# Altium project TMDX654GPEVM.PrjPcb (part 8 of 24)

## Sheet 22-RGMII ETHERNET PHY - MCU.SchDoc
size 513 x 386 mm
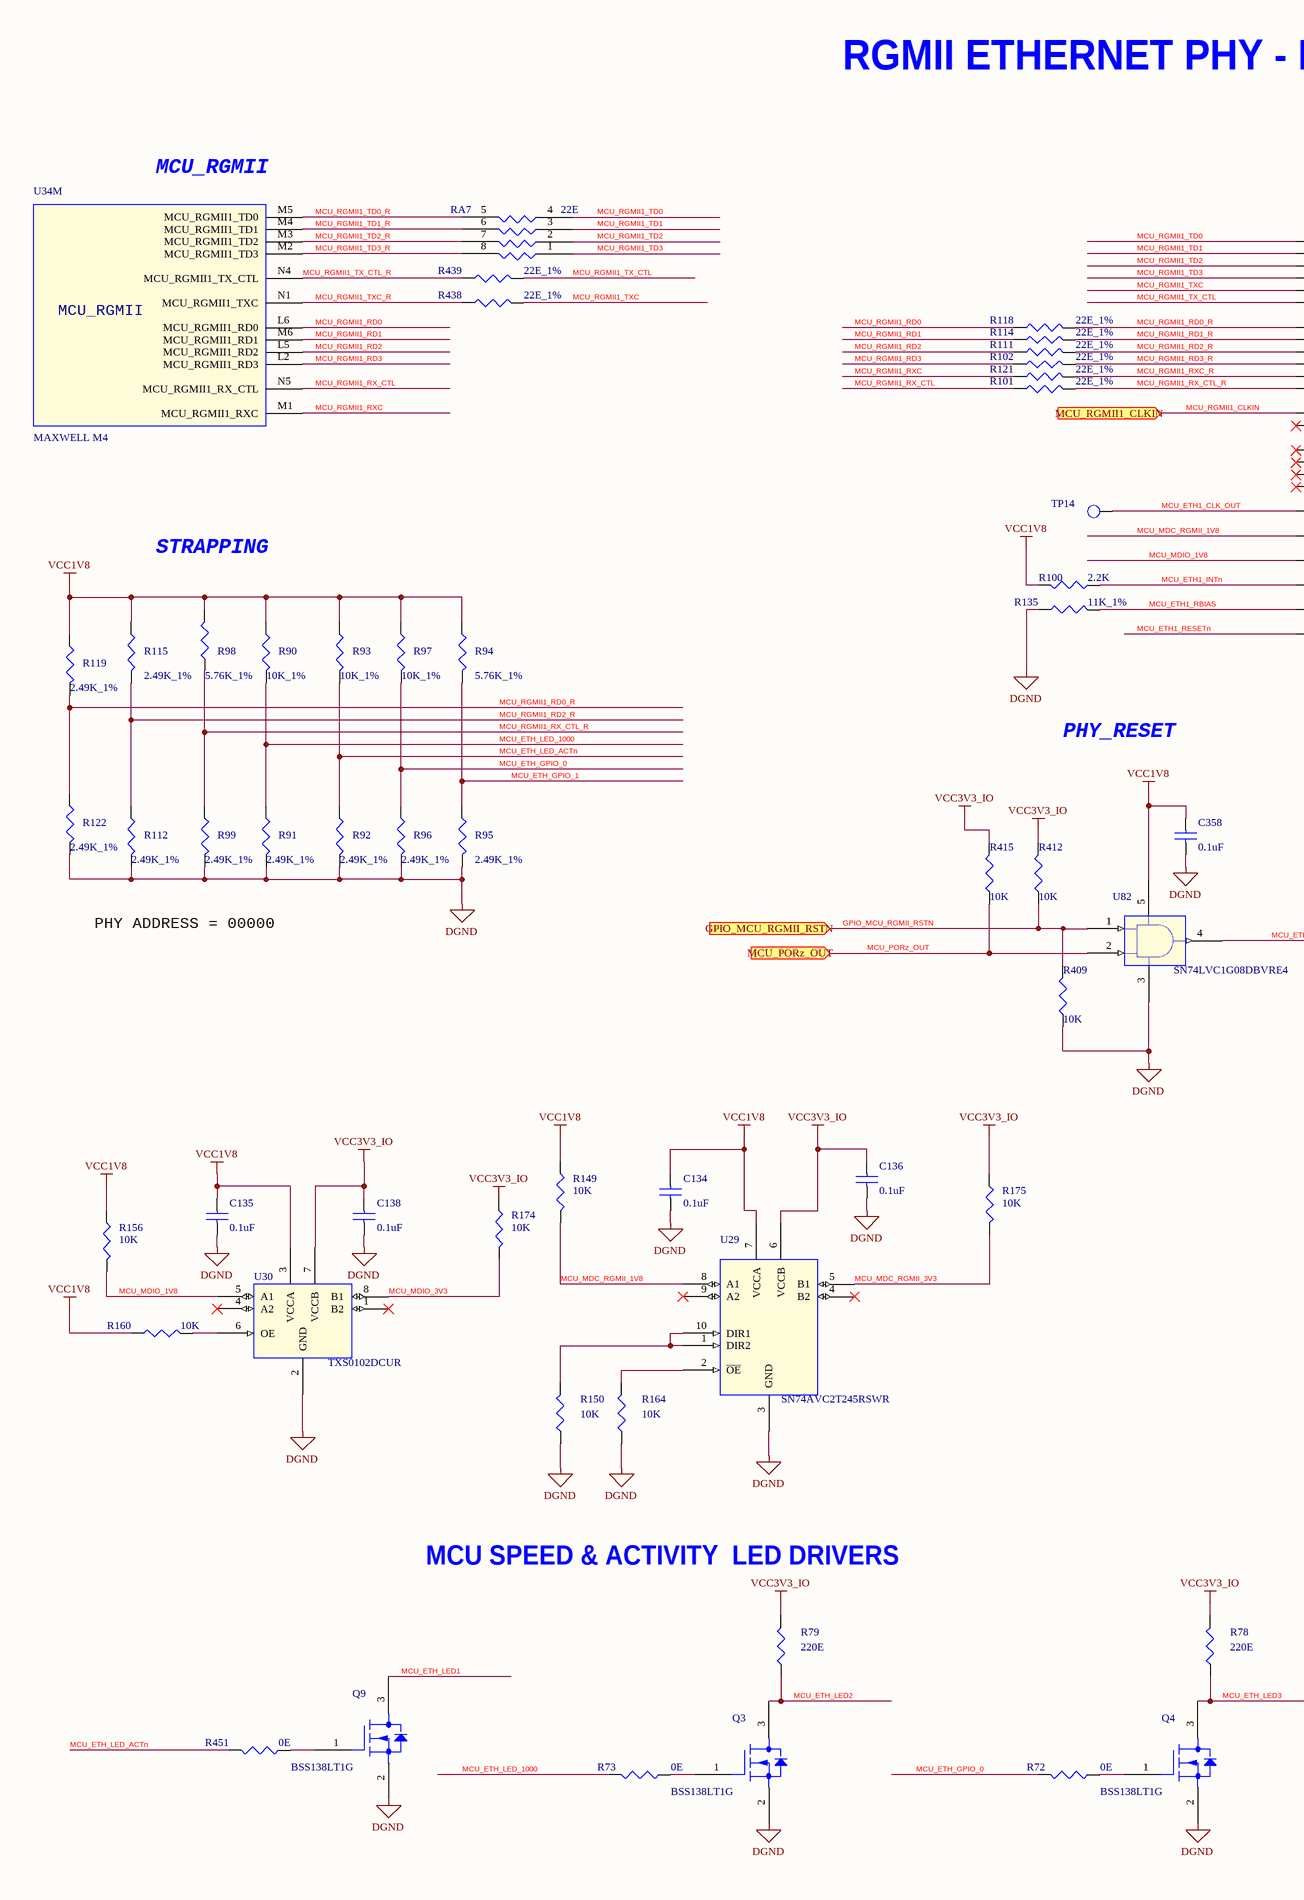
[diagram p36: 22-RGMII ETHERNET PHY - MCU.SchDoc, left]
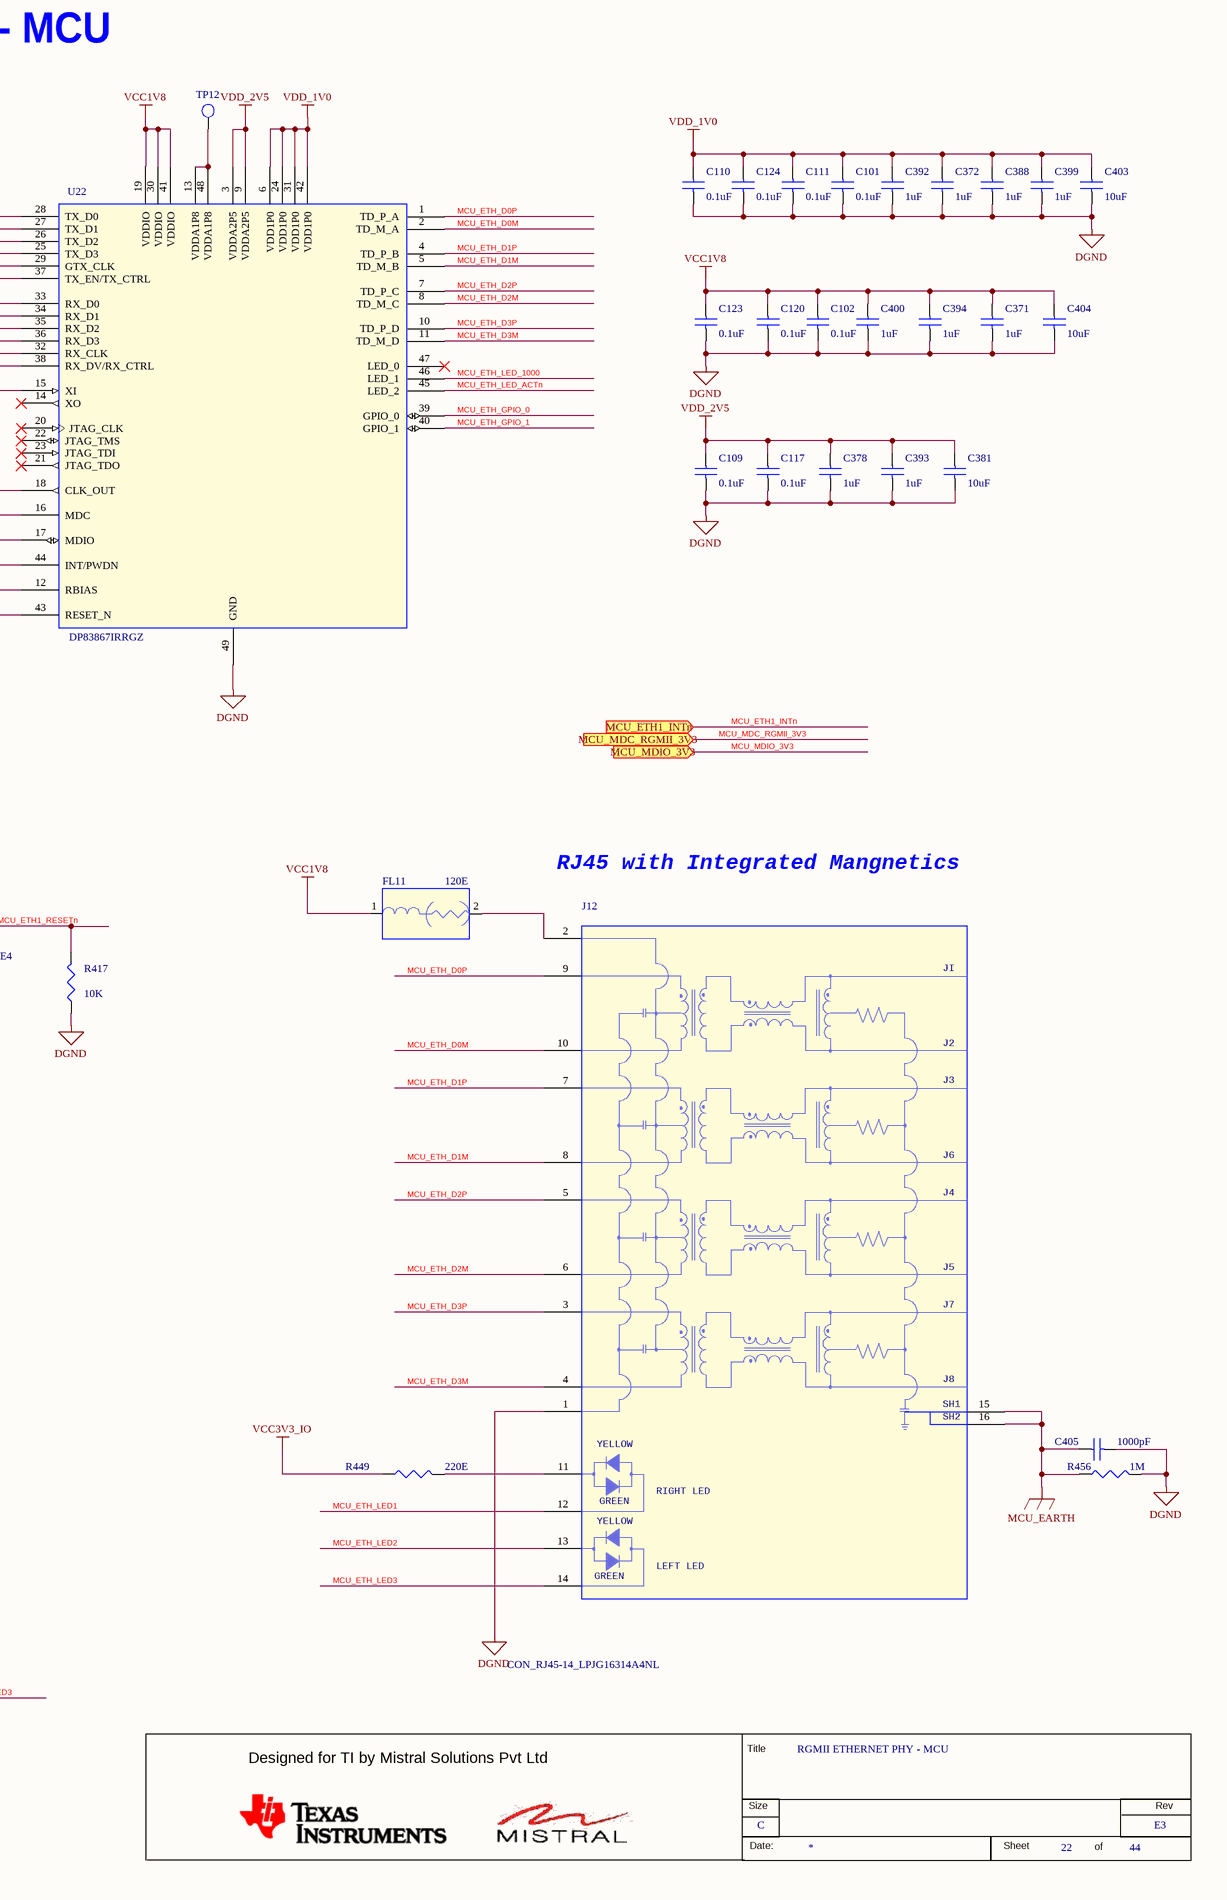
[diagram p37: 22-RGMII ETHERNET PHY - MCU.SchDoc, right]

### Parts
(Parts that share a designator on the sheet are numbered #1, #2 ... from top to bottom, then left to right.)
*#22  RevCode: E3  Title: RGMII ETHERNET PHY - MCU  Page Size: C  Page Number: 22  Page Count: 44  (hidden comment: MISTRAL_TITLEBLK_CSIZE)  (graphical)
C101  0.1uF  [CAP0201_0-5]
C102  0.1uF  [CAP0201_0-5]
C109  0.1uF  [CAP0201_0-5]
C110  0.1uF  [CAP0201_0-5]
C111  0.1uF  [CAP0201_0-5]
C117  0.1uF  [CAP0201_0-5]
C120  0.1uF  [CAP0201_0-5]
C123  0.1uF  [CAP0201_0-5]
C124  0.1uF  [CAP0201_0-5]
C134  0.1uF  [CAP0201_0-5]
C135  0.1uF  [CAP0201_0-5]
C136  0.1uF  [CAP0201_0-5]
C138  0.1uF  [CAP0201_0-5]
C358  0.1uF  [CAP0201_0-5]
C371  1uF  [CAP0402_0-75]
C372  1uF  [CAP0402_0-75]
C378  1uF  [CAP0402_0-75]
C381  10uF  [CAP0603_1]
C388  1uF  [CAP0402_0-75]
C392  1uF  [CAP0402_0-75]
C393  1uF  [CAP0402_0-75]
C394  1uF  [CAP0402_0-75]
C399  1uF  [CAP0402_0-75]
C400  1uF  [CAP0402_0-75]
C403  10uF  [CAP0603_1]
C404  10uF  [CAP0603_1]
C405  1000pF  [CAP1206]
FL11  120E  [EMIFIL_BLM15A_0402_0-6]
J12  CON_RJ45-14_LPJG16314A4NL  [CON_RJ45-14_LPJG16314A4NL_S_R_T_13-6]
Q3  BSS138LT1G  [SOT23-123]
Q4  BSS138LT1G  [SOT23-123]
Q9  BSS138LT1G  [SOT23-123]
R72  0E  [RES0402_0-5]
R73  0E  [RES0402_0-5]
R78  220E  [RES0402_0-5]
R79  220E  [RES0402_0-5]
R90  10K_1%  [RES0402_0-5]
R91  2.49K_1%  [RES0402]
R92  2.49K_1%  [RES0402]
R93  10K_1%  [RES0402_0-5]
R94  5.76K_1%  [RES0402]
R95  2.49K_1%  [RES0402]
R96  2.49K_1%  [RES0402]
R97  10K_1%  [RES0402_0-5]
R98  5.76K_1%  [RES0402]
R99  2.49K_1%  [RES0402]
R100  2.2K  [RES0402_0-5]
R101  22E_1%  [RES0402]
R102  22E_1%  [RES0402]
R111  22E_1%  [RES0402]
R112  2.49K_1%  [RES0402]
R114  22E_1%  [RES0402]
R115  2.49K_1%  [RES0402]
R118  22E_1%  [RES0402]
R119  2.49K_1%  [RES0402]
R121  22E_1%  [RES0402]
R122  2.49K_1%  [RES0402]
R135  11K_1%  [RES0402_0-5]
R149  10K  [RES0201]
R150  10K  [RES0402_0-5]
R156  10K  [RES0201]
R160  10K  [RES0402_0-5]
R164  10K  [RES0402_0-5]
R174  10K  [RES0201]
R175  10K  [RES0201]
R409  10K  [RES0402_0-5]
R412  10K  [RES0402_0-5]
R415  10K  [RES0402_0-5]
R417  10K  [RES0402_0-5]
R438  22E_1%  [RES0402]
R439  22E_1%  [RES0402]
R449  220E  [RES0402_0-5]
R451  0E  [RES0402_0-5]
R456  1M  [RES0603_0-75]
RA7  22E  [RESA_EXB28V_0402-4_0-5]
TP12  TP40_SMD  [TP40_SMD]  (value not drawn)
TP14  TP40_SMD  [TP40_SMD]  (value not drawn)
U22  DP83867IRRGZ  [QFN48_19-68_280X280_1]
U29  SN74AVC2T245RSWR  [QFN10_15-74_75X60]
U30  TXS0102DCUR  [VSSOP8_19-68_85X95_0-9]
U34  MAXWELL M4  [BGA784_31-49_910X910_1-7]  (part M of 19)
U82  SN74LVC1G08DBVRE4  [SOT23-5]

### Ports
GPIO_MCU_RGMII_RSTN (in), MCU_ETH1_INTn (in), MCU_MDC_RGMII_3V3 (in), MCU_MDIO_3V3 (in), MCU_PORz_OUT (in), MCU_RGMII1_CLKIN (in)

### Nets
DGND: C101.2 C102.2 C109.2 C110.2 C111.2 C117.2 C120.2 C123.2 C124.2 C134.2 C135.2 C136.2 C138.2 C358.2 C371.2 C372.2 C378.2 C381.2 C388.2 C392.2 C393.2 C394.2 C399.2 C400.2 C403.2 C404.2 C405.2 J12.1(CH-GND) Q3.2(S) Q4.2(S) Q9.2(S) R91.2 R92.2 R95.2 R96.2 R99.2 R112.2 R122.2 R135.2 R150.1 R164.1 R409.1 R417.2 R456.2 U22.49(GND) U29.3(GND) U30.2(GND) U82.3(GND)
MCU_EARTH: C405.1 J12.15(SH1) J12.16(SH2) R456.1
VCC1V8: C102.1 C120.1 C123.1 C134.1 C135.1 C358.1 C371.1 C394.1 C400.1 C404.1 FL11.1 R90.1 R93.1 R94.1 R97.1 R98.2 R100.2 R115.1 R119.1 R149.1 R156.1 R160.1 U22.19(VDDIO) U22.30(VDDIO) U22.41(VDDIO) U29.7(VCCA) U30.3(VCCA) U82.5(VCC)
VCC3V3_IO: C136.1 C138.1 R78.2 R79.2 R174.1 R175.1 R412.2 R415.2 R449.1 U29.6(VCCB) U30.7(VCCB)
VDD_1V0: C101.1 C110.1 C111.1 C124.1 C372.1 C388.1 C392.1 C399.1 C403.1 U22.6(VDD1P0) U22.24(VDD1P0) U22.31(VDD1P0) U22.42(VDD1P0)
VDD_2V5: C109.1 C117.1 C378.1 C381.1 C393.1 U22.3(VDDA2P5) U22.9(VDDA2P5)
GPIO_MCU_RGMII_RSTN: R409.2 R412.1 U82.1(A) ; port GPIO_MCU_RGMII_RSTN
MCU_ETH1_CLK_OUT: TP14.1(TP) U22.18(CLK_OUT)
MCU_ETH1_INTn: R100.1 U22.44(INT/PWDN) ; port MCU_ETH1_INTn
MCU_ETH1_RBIAS: R135.1 U22.12(RBIAS)
MCU_ETH1_RESETn: R417.1 U22.43(RESET_N) U82.4(Y)
MCU_ETH_D0M: J12.10(MX0-) U22.2(TD_M_A)
MCU_ETH_D0P: J12.9(MX0+) U22.1(TD_P_A)
MCU_ETH_D1M: J12.8(MX1-) U22.5(TD_M_B)
MCU_ETH_D1P: J12.7(MX1+) U22.4(TD_P_B)
MCU_ETH_D2M: J12.6(MX2-) U22.8(TD_M_C)
MCU_ETH_D2P: J12.5(MX2+) U22.7(TD_P_C)
MCU_ETH_D3M: J12.4(MX3-) U22.11(TD_M_D)
MCU_ETH_D3P: J12.3(MX3+) U22.10(TD_P_D)
MCU_ETH_GPIO_0: R72.2 R96.1 R97.2 U22.39(GPIO_0)
MCU_ETH_GPIO_1: R94.2 R95.1 U22.40(GPIO_1)
MCU_ETH_LED1: J12.12 Q9.3(D)
MCU_ETH_LED2: J12.13 Q3.3(D) R79.1
MCU_ETH_LED3: J12.14 Q4.3(D) R78.1
MCU_ETH_LED_1000: R73.2 R90.2 R91.1 U22.46(LED_1)
MCU_ETH_LED_ACTn: R92.1 R93.2 R451.2 U22.45(LED_2)
MCU_MDC_RGMII_1V8: R149.2 U22.16(MDC) U29.8(A1)
MCU_MDC_RGMII_3V3: R175.2 U29.5(B1) ; port MCU_MDC_RGMII_3V3
MCU_MDIO_1V8: R156.2 U22.17(MDIO) U30.5(A1)
MCU_MDIO_3V3: R174.2 U30.8(B1) ; port MCU_MDIO_3V3
MCU_PORz_OUT: R415.1 U82.2(B) ; port MCU_PORz_OUT
MCU_RGMII1_CLKIN: U22.15(XI) ; port MCU_RGMII1_CLKIN
MCU_RGMII1_RD0: R118.1 U34.L6(MCU_RGMII1_RD0)
MCU_RGMII1_RD0_R: R118.2 R119.2 R122.1 U22.33(RX_D0)
MCU_RGMII1_RD1: R114.1 U34.M6(MCU_RGMII1_RD1)
MCU_RGMII1_RD1_R: R114.2 U22.34(RX_D1)
MCU_RGMII1_RD2: R111.1 U34.L5(MCU_RGMII1_RD2)
MCU_RGMII1_RD2_R: R111.2 R112.1 R115.2 U22.35(RX_D2)
MCU_RGMII1_RD3: R102.1 U34.L2(MCU_RGMII1_RD3)
MCU_RGMII1_RD3_R: R102.2 U22.36(RX_D3)
MCU_RGMII1_RX_CTL: R101.1 U34.N5(MCU_RGMII1_RX_CTL)
MCU_RGMII1_RX_CTL_R: R98.1 R99.1 R101.2 U22.38(RX_DV/RX_CTRL)
MCU_RGMII1_RXC: R121.1 U34.M1(MCU_RGMII1_RXC)
MCU_RGMII1_RXC_R: R121.2 U22.32(RX_CLK)
MCU_RGMII1_TD0: RA7.4 U22.28(TX_D0)
MCU_RGMII1_TD0_R: RA7.5 U34.M5(MCU_RGMII1_TD0)
MCU_RGMII1_TD1: RA7.3 U22.27(TX_D1)
MCU_RGMII1_TD1_R: RA7.6 U34.M4(MCU_RGMII1_TD1)
MCU_RGMII1_TD2: RA7.2 U22.26(TX_D2)
MCU_RGMII1_TD2_R: RA7.7 U34.M3(MCU_RGMII1_TD2)
MCU_RGMII1_TD3: RA7.1 U22.25(TX_D3)
MCU_RGMII1_TD3_R: RA7.8 U34.M2(MCU_RGMII1_TD3)
MCU_RGMII1_TX_CTL: R439.2 U22.37(TX_EN/TX_CTRL)
MCU_RGMII1_TX_CTL_R: R439.1 U34.N4(MCU_RGMII1_TX_CTL)
MCU_RGMII1_TXC: R438.2 U22.29(GTX_CLK)
MCU_RGMII1_TXC_R: R438.1 U34.N1(MCU_RGMII1_TXC)
NetFL11_2: FL11.2 J12.2(VCC)
NetJ12_11: J12.11 R449.2
NetQ3_1: Q3.1(G) R73.1
NetQ4_1: Q4.1(G) R72.1
NetQ9_1: Q9.1(G) R451.1
NetR150_2: R150.2 U29.1(DIR2) U29.10(DIR1)
NetR160_2: R160.2 U30.6(OE)
NetR164_2: R164.2 U29.2(~{OE})
NetTP12_1: TP12.1(TP) U22.13(VDDA1P8) U22.48(VDDA1P8)

Not connected (* = marked no-connect by the designer): U22 14(XO)* 20(JTAG_CLK)* 21(JTAG_TDO)* 22(JTAG_TMS)* 23(JTAG_TDI)* 47(LED_0)*; U29 4(B2)* 9(A2)*; U30 1(B2)* 4(A2)*

### Notes on the sheet
- RGMII ETHERNET PHY - MCU
- (near U34) MCU_RGMII
- STRAPPING
- PHY_RESET
- RJ45 with Integrated Mangnetics
- PHY ADDRESS = 00000
- MCU SPEED & ACTIVITY  LED DRIVERS
- (in symbol AM654X_BGA784, part M) MCU_RGMII
- (in symbol CON_RJ45-14_LPJG16314A4NL) JI; J2; J3; J6; J4; J5; J7; J8; YELLOW; RIGHT LED; GREEN; LEFT LED
- (in symbol MISTRAL_TITLEBLK_CSIZE) Title; Designed for TI by Mistral Solutions Pvt Ltd; Size; Rev; Date:; Sheet; of

### Library data of the parts
*#22 = MISTRAL_TITLEBLK_CSIZE: Issue: 1.0; Page Create Date: March  8, 1995; Page Modify Date: *
C101 C102 C111 C117 C120 C123 = CAP_Dup5: as C126 on sheet 20-RGMII ETHERNET PHY - ICSSG PRG2_PRU0; Tolerance: 10%; Voltage: 16V; Package: 0201; Distributor_name: DIGIKEY; Distributor_part_number: 490-16742-1-ND; Height: 0.33MM; Weight: 0.33mg; Temperature: -55°C+85°C; Datasheet: Y:\MIS_DATABASE\DATASHEETS\CAPACITORS\GRM033R61C104KE84.PDF; Crtd /date: MANIRAJA/120218; Chkd/date: MANIRAJA/120218; MECHANICAL 3D STEP FILE: CAP0201_0-5; PCB Footprint: CAP0201_0-5; Library Ref: CAP
C109 C110 C124 C134-C136 C138 C358 = CAP_Dup5: as C13 on sheet 19-EEPROM,PRESENCE DETECTION & TEMP SENSOR; MECHANICAL 3D STEP FILE: CAP0201_0-5; Chkd/date: MANIRAJA/120218; Crtd /date: MANIRAJA/120218; Datasheet: Y:\MIS_DATABASE\DATASHEETS\CAPACITORS\GRM033R61C104KE84.PDF; Temperature: -55°C+85°C; Weight: 0.33mg; Height: 0.33MM; Distributor_part_number: 490-16742-1-ND; Distributor_name: DIGIKEY; Package: 0201; Voltage: 16V; Tolerance: 10%; PCB Footprint: CAP0201_0-5; Library Ref: CAP
C371 C372 C394 C399 C400 = CAP_Dup5: as C406 on sheet 20-RGMII ETHERNET PHY - ICSSG PRG2_PRU0; Footprint Path: Y:\MIS_DATABASE\Library\ALTIUM_TOOL\PCB_FOOTPRINTS\Altium_Footprint_Lib.PcbLib; Library Path: Y:\MIS_DATABASE\Library\ALTIUM_TOOL\SCHEMATICS_PARTS\MS_DISCRETE_Library.schlib; MECHANICAL 3D STEP FILE: CAP0402_0-75; PCB Footprint: CAP0402_0-75; Tolerance: 20%; Voltage: 16V; Package: 0402; Distributor_name: DIGIKEY; Distributor_part_number: 587-5514-1-ND; Height: 0.55MM; Weight: 0.65mg; Temperature: -55°C+85°C; Datasheet: Y:\MIS_DATABASE\DATASHEETS\CAPACITORS\EMK105BJ105MV-F.PDF; Crtd /date: ALVY/150218; Chkd/date: MANIRAJA/150218; Library Ref: CAP; Footprint Ref: CAP0402_0-75
C378 C388 C392 C393 = CAP_Dup5: as C424 on sheet 20-RGMII ETHERNET PHY - ICSSG PRG2_PRU0; Footprint Path: Y:\MIS_DATABASE\Library\ALTIUM_TOOL\PCB_FOOTPRINTS\Altium_Footprint_Lib.PcbLib; Library Path: Y:\MIS_DATABASE\Library\ALTIUM_TOOL\SCHEMATICS_PARTS\MS_DISCRETE_Library.schlib; MECHANICAL 3D STEP FILE: CAP0402_0-75; PCB Footprint: CAP0402_0-75; Chkd/date: MANIRAJA/150218; Crtd /date: ALVY/150218; Datasheet: Y:\MIS_DATABASE\DATASHEETS\CAPACITORS\EMK105BJ105MV-F.PDF; Temperature: -55°C+85°C; Weight: 0.65mg; Height: 0.55MM; Distributor_part_number: 587-5514-1-ND; Distributor_name: DIGIKEY; Package: 0402; Voltage: 16V; Tolerance: 20%; Library Ref: CAP; Footprint Ref: CAP0402_0-75
C381 C403 = CAP_Dup5: CAP CERAMIC 10uF 10V 10% X5R 0603; Part_type: CAPACITORS\CERAMIC; Mfr_part_number: 0603ZD106KAT2A; Mfr_name: AVX CORPORATION; Mistral Part No: 120010080001-R; Custom_Duty: 15%; Customs_HS_Code: 85322990; Project: TI_MAXIE_CPB; Wattage: NA; Chkd/date: MANIRAJA/230118; Crtd /date: MANIRAJA/230118; Datasheet: Y:\MIS_DATABASE\DATASHEETS\CAPACITORS\AVX_MLC.PDF; Height: 0.94MM; Distributor_part_number: 478-10766-1-ND; Distributor_name: DIGIKEY; Package: 0603; Voltage: 10V; Tolerance: 10%; PCB Footprint: CAP0603_1; Weight: 2mg; Temperature: -55°C+85°C; MECHANICAL 3D STEP FILE: CAP0603_1; Library Ref: CAP
C404 = CAP_Dup5: as C471 on sheet 20-RGMII ETHERNET PHY - ICSSG PRG2_PRU0; Tolerance: 10%; Voltage: 10V; Package: 0603; Distributor_name: DIGIKEY; Distributor_part_number: 478-10766-1-ND; Height: 0.94MM; Datasheet: Y:\MIS_DATABASE\DATASHEETS\CAPACITORS\AVX_MLC.PDF; Crtd /date: MANIRAJA/230118; Chkd/date: MANIRAJA/230118; PCB Footprint: CAP0603_1; Weight: 2mg; Temperature: -55°C+85°C; MECHANICAL 3D STEP FILE: CAP0603_1; Library Ref: CAP
C405 = CAP_Dup5: as C489 on sheet 20-RGMII ETHERNET PHY - ICSSG PRG2_PRU0; Tolerance: 10%; Voltage: 2KV; Package: 1206; Distributor_name: DIGIKEY; Distributor_part_number: 478-2956-1-ND; Height: 1.50MM; Weight: NA; Temperature: -55°C+125°C; Datasheet: Y:\MIS_DATABASE\DATASHEETS\CAPACITORS\AVX_MLC.PDF; Crtd /date: MAZHAR/281106; Chkd/date: SHREESHAIL/291106; PCB Footprint: CAP1206; Library Ref: CAP; Footprint Ref: CAP1206; Library Path: Y:\MIS_DATABASE\Library\ALTIUM_TOOL\SCHEMATICS_PARTS\MS_DISCRETE_Library.schlib; Footprint Path: Y:\MIS_DATABASE\Library\ALTIUM_TOOL\PCB_FOOTPRINTS\Altium_Footprint_Lib.PcbLib
FL11 = EMIFILTER_IND: FERRITE CHIP 120E 1.3A 0402; Mistral Part No: 130012030043-R; Mfr_name: MURATA; Mfr_part_number: BLM15PD121SN1; Part_type: MISC\FILTER; Project: GEN_3-8; Tolerance: 25%; Voltage: NA; Customs_HS_Code: 85437099; Custom_Duty: 24%; Wattage: NA; Package: 0402; Distributor_name: DIGIKEY; Distributor_part_number: 490-5203-1-ND; Height: 0.55MM; Weight: 0.65mg; Temperature: -55°C+125°C; Datasheet: Y:\MIS_DATABASE\DATASHEETS\DISCRETES\INDUCTORS\BLM18K-SERIES.PDF; Crtd /date: CHAITHANYA/150312; Chkd/date: VASANTHA/010117; MECHANICAL 3D STEP FILE: EMIFIL_BLM15A_0402_0-6; PCB Footprint: EMIFIL_BLM15A_0402_0-6; Library Ref: EMIFILTER_IND; Footprint Ref: EMIFIL_BLM15A_0402_0-6; Library Path: Y:\MIS_DATABASE\Library\ALTIUM_TOOL\SCHEMATICS_PARTS\MS_FILTER_Library.schlib; Footprint Path: Y:\MIS_DATABASE\Library\ALTIUM_TOOL\PCB_FOOTPRINTS\Altium_Footprint_Lib.PcbLib
J12 = CON_RJ45-14_LPJG16314A4NL: CON RJ-45 FEMALE 14POS RT TH; Part_type: CONNECTOR\JACK; Mfr_name: LINK-PP; Mistral Part No: 150014060029-R; Custom_Duty: 24%; Customs_HS_Code: 85369090; Wattage: NA; Project: AEGIS; MECHANICAL 3D STEP FILE: CON_RJ45-14_LPJG16314A4NL_S_R_T_13-6; Chkd/date: VASANTHA/150714; Crtd /date: BALACHANDAR/120614; Datasheet: Y:\MIS_DATABASE\DATASHEETS\CONNECTORS\LPJG16314A4NL.PDF; Temperature: -0°C+70°C; Weight: NA; Height: 13.60MM; Distributor_part_number: NA; Distributor_name: NA; Package: THRU-HOLE; Voltage: NA; Tolerance: NA; Mfr_part_number: LPJG16314A4NL; PCB Footprint: CON_RJ45-14_LPJG16314A4NL_S_R_T_13-6; Library Ref: CON_RJ45-14_LPJG16314A4NL; Footprint Ref: CON_RJ45-14_LPJG16314A4NL_S_R_T_13-6; Library Path: Y:\MIS_DATABASE\Library\ALTIUM_TOOL\SCHEMATICS_PARTS\MS_CONNECTOR_Library.schlib; Footprint Path: Y:\MIS_DATABASE\Library\ALTIUM_TOOL\PCB_FOOTPRINTS\Altium_Footprint_Lib.PcbLib
Q3 Q4 Q9 = MOSFET_BSS138LT1G: as Q13 on sheet 20-RGMII ETHERNET PHY - ICSSG PRG2_PRU0; PCB Footprint: SOT23-123; Mfr_part_number: BSS138LT1G; Voltage: 50V; Wattage: NA; Package: SOT23-3; Distributor_name: MOUSER; Distributor_part_number: 863-BSS138LT1G; Height: 1.11MM; Weight: NA; Temperature: -55°C+150°C; Datasheet: Y:\MIS_DATABASE\DATASHEETS\DISCRETES\TRANSISTORS_FETS\BSS138LT1G.PDF; Crtd /date: JEBRAN/060416; Chkd/date: VASANTHA/150416; Library Ref: MOSFET_BSS138LT1G
R72 R73 R451 = RESISTOR_Dup4: as R468 on sheet 20-RGMII ETHERNET PHY - ICSSG PRG2_PRU0; MECHANICAL 3D STEP FILE: RES0402_0-5; PCB Footprint: RES0402_0-5; Voltage: NA; Wattage: 1/16W; Package: 0402; Distributor_name: DIGIKEY; Distributor_part_number: 541-0.0JCT-ND; Height: 0.40MM; Weight: 0.65g/1000pcs; Temperature: -55°C+155°C; Datasheet: Y:\MIS_DATABASE\DATASHEETS\RESISTORS\CRCW0603.PDF; Crtd /date: MUDDU/190810; Chkd/date: VASANTHA/201216; RoHS: Pb-Free; Library Ref: RESISTOR; Footprint Ref: RES0402_0-5; Library Path: Y:\MIS_DATABASE\Library\ALTIUM_TOOL\SCHEMATICS_PARTS\MS_DISCRETE_Library.schlib; Footprint Path: Y:\MIS_DATABASE\Library\ALTIUM_TOOL\PCB_FOOTPRINTS\Altium_Footprint_Lib.PcbLib
R78 R79 = RESISTOR_Dup5: RES 220E 1/16W 5% 0402; Mistral Part No: 110009030506-R; Mfr_name: PANASONIC-ECG; Mfr_part_number: ERJ-2GEJ221X; Part_type: RESISTORS\FIXED; Project: RED EYE; Customs_HS_Code: 85332119; Custom_Duty: 15%; Voltage: NA; Tolerance: 5%; Wattage: 1/16W; Package: 0402; Distributor_name: DIGIKEY; Distributor_part_number: P220JCT-ND; Height: 0.40MM; Datasheet: Y:\MIS_DATABASE\DATASHEETS\RESISTORS\ERJ12.PDF; Crtd /date: GEETHA/260406; Chkd/date: VASANTHA/291216; Library Ref: RESISTOR; PCB Footprint: RES0402_0-5; Weight: 0.8g/1000pcs; Temperature: -55°C+155°C; MECHANICAL 3D STEP FILE: RES0402_0-5; Library Path: Y:\MIS_DATABASE\Library\ALTIUM_TOOL\SCHEMATICS_PARTS\MS_DISCRETE_Library.schlib; Footprint Path: Y:\MIS_DATABASE\Library\ALTIUM_TOOL\PCB_FOOTPRINTS\Altium_Footprint_Lib.PcbLib
R90 R93 = RESISTOR_Dup5: as R144 on sheet 20-RGMII ETHERNET PHY - ICSSG PRG2_PRU0; RoHS: Pb-Free; Chkd/date: VASANTHA/201216; Crtd /date: GEETHA/290506; Datasheet: Y:\MIS_DATABASE\DATASHEETS\RESISTORS\YAGEO-RC0402.PDF; Temperature: -55°C+155°C; Weight: 0.65mg; Height: 0.40MM; Distributor_part_number: 311-10.0KLRTR-ND; Distributor_name: DIGIKEY; Package: 0402; Wattage: 1/16W; Tolerance: 1%; MECHANICAL 3D STEP FILE: RES0402_0-5; PCB Footprint: RES0402_0-5; Library Ref: RESISTOR; Footprint Ref: RES0402_0-5; Library Path: Y:\MIS_DATABASE\Library\ALTIUM_TOOL\SCHEMATICS_PARTS\MS_DISCRETE_Library.schlib; Footprint Path: Y:\MIS_DATABASE\Library\ALTIUM_TOOL\PCB_FOOTPRINTS\Altium_Footprint_Lib.PcbLib
R91 R92 R95 R96 R99 R112 R115 R122 = RESISTOR_Dup5: as R138 on sheet 20-RGMII ETHERNET PHY - ICSSG PRG2_PRU0; Tolerance: 1%; Wattage: 1/16W; Package: 0402; Distributor_name: DIGIKEY; Distributor_part_number: 311-2.49KLRCT-ND; Height: 0.40MM; Weight: NA; Temperature: -55°C+155°C; Datasheet: Y:\MIS_DATABASE\DATASHEETS\RESISTORS\RC0402FR.PDF; Crtd /date: VASANTHA/270516; Chkd/date: VASANTHA/270516; PCB Footprint: RES0402; Library Ref: RESISTOR
R94 = RESISTOR_Dup5: as R145 on sheet 20-RGMII ETHERNET PHY - ICSSG PRG2_PRU0; Tolerance: 1%; Wattage: 1/10W; Package: 0402; Distributor_name: DIGIKEY; Distributor_part_number: P5.76KLCT-ND; Height: 0.40MM; Datasheet: Y:\MIS_DATABASE\DATASHEETS\RESISTORS\PAN-ERJSERIES.PDF; Crtd /date: USMAN/220808; Chkd/date: MAZHAR/150709; PCB Footprint: RES0402; Library Ref: RESISTOR; Library Path: Y:\MIS_DATABASE\Library\ALTIUM_TOOL\SCHEMATICS_PARTS\MS_DISCRETE_Library.schlib; Footprint Path: Y:\MIS_DATABASE\Library\ALTIUM_TOOL\PCB_FOOTPRINTS\Altium_Footprint_Lib.PcbLib
R97 = RESISTOR_Dup5: as R137 on sheet 20-RGMII ETHERNET PHY - ICSSG PRG2_PRU0; Tolerance: 1%; Wattage: 1/16W; Package: 0402; Distributor_name: DIGIKEY; Distributor_part_number: 311-10.0KLRTR-ND; Height: 0.40MM; Weight: 0.65mg; Temperature: -55°C+155°C; Datasheet: Y:\MIS_DATABASE\DATASHEETS\RESISTORS\YAGEO-RC0402.PDF; Crtd /date: GEETHA/290506; Chkd/date: VASANTHA/201216; RoHS: Pb-Free; MECHANICAL 3D STEP FILE: RES0402_0-5; PCB Footprint: RES0402_0-5; Library Ref: RESISTOR; Footprint Ref: RES0402_0-5; Library Path: Y:\MIS_DATABASE\Library\ALTIUM_TOOL\SCHEMATICS_PARTS\MS_DISCRETE_Library.schlib; Footprint Path: Y:\MIS_DATABASE\Library\ALTIUM_TOOL\PCB_FOOTPRINTS\Altium_Footprint_Lib.PcbLib
R98 = RESISTOR_Dup5: as R141 on sheet 20-RGMII ETHERNET PHY - ICSSG PRG2_PRU0; Chkd/date: MAZHAR/150709; Crtd /date: USMAN/220808; Datasheet: Y:\MIS_DATABASE\DATASHEETS\RESISTORS\PAN-ERJSERIES.PDF; Height: 0.40MM; Distributor_part_number: P5.76KLCT-ND; Distributor_name: DIGIKEY; Package: 0402; Wattage: 1/10W; Tolerance: 1%; PCB Footprint: RES0402; Library Ref: RESISTOR; Library Path: Y:\MIS_DATABASE\Library\ALTIUM_TOOL\SCHEMATICS_PARTS\MS_DISCRETE_Library.schlib; Footprint Path: Y:\MIS_DATABASE\Library\ALTIUM_TOOL\PCB_FOOTPRINTS\Altium_Footprint_Lib.PcbLib
R100 = RESISTOR_Dup5: as R198 on sheet 20-RGMII ETHERNET PHY - ICSSG PRG2_PRU0; Footprint Path: VALUE IS VAILABLE 3 TIMES; MECHANICAL 3D STEP FILE: RES0402_0-5; Chkd/date: VASANTHA/061216; Crtd /date: BAVISH/021210; Datasheet: Y:\MIS_DATABASE\DATASHEETS\RESISTORS\YAGEO.PDF; Temperature: -55°C+155°C; Weight: 0.65mg; Height: 0.40MM; Distributor_part_number: 311-2.2KJRCT-ND; Distributor_name: DIGIKEY; Package: 0402; Wattage: 1/16W; Tolerance: 5%; PCB Footprint: RES0402_0-5; Library Ref: RESISTOR
R101 R111 R118 R438 = RESISTOR_Dup5: as R154 on sheet 20-RGMII ETHERNET PHY - ICSSG PRG2_PRU0; RoHS: Pb-Free; Chkd/date: SUHAS/290910; Crtd /date: MAZHAR/090909; Datasheet: Y:\MIS_DATABASE\DATASHEETS\RESISTORS\YAGEO-RC0402.PDF; Temperature: -55°C+155°C; Weight: 0.8g/1000pcs; Height: 0.40MM; Distributor_part_number_A: 541-22.0LCT-ND; Distributor_name_A: DIGIKEY; Distributor_part_number: 311-22.0LRCT-ND; Distributor_name: DIGIKEY; Package: 0402; Wattage: 1/16W; Tolerance: 1%; PCB Footprint: RES0402; SIGNAL_MODEL: RES; Library Ref: RESISTOR
R102 R114 R121 R439 = RESISTOR_Dup5: as R152 on sheet 20-RGMII ETHERNET PHY - ICSSG PRG2_PRU0; Tolerance: 1%; Wattage: 1/16W; Package: 0402; Distributor_name: DIGIKEY; Distributor_part_number: 311-22.0LRCT-ND; Distributor_name_A: DIGIKEY; Distributor_part_number_A: 541-22.0LCT-ND; Height: 0.40MM; Weight: 0.8g/1000pcs; Temperature: -55°C+155°C; Datasheet: Y:\MIS_DATABASE\DATASHEETS\RESISTORS\YAGEO-RC0402.PDF; Crtd /date: MAZHAR/090909; Chkd/date: SUHAS/290910; RoHS: Pb-Free; PCB Footprint: RES0402; SIGNAL_MODEL: RES; Library Ref: RESISTOR
R119 = RESISTOR_Dup5: as R142 on sheet 20-RGMII ETHERNET PHY - ICSSG PRG2_PRU0; Chkd/date: VASANTHA/270516; Crtd /date: VASANTHA/270516; Datasheet: Y:\MIS_DATABASE\DATASHEETS\RESISTORS\RC0402FR.PDF; Temperature: -55°C+155°C; Weight: NA; Height: 0.40MM; Distributor_part_number: 311-2.49KLRCT-ND; Distributor_name: DIGIKEY; Package: 0402; Wattage: 1/16W; Tolerance: 1%; PCB Footprint: RES0402; Library Ref: RESISTOR
R135 = RESISTOR_Dup5: as R188 on sheet 20-RGMII ETHERNET PHY - ICSSG PRG2_PRU0; Tolerance: 1%; Wattage: 1/16W; Package: 0402; Distributor_name: DIGIKEY; Distributor_part_number: 311-11.0KLRCT-ND; Height: 0.40MM; Weight: 0.65mg; Temperature: -55°C+155°C; Datasheet: Y:\MIS_DATABASE\DATASHEETS\RESISTORS\YAGEO-RC0402.PDF; Crtd /date: VASANTHA/251115; Chkd/date: VASANTHA/251115; RoHS: Pb-Free; MECHANICAL 3D STEP FILE: RES0402_0-5; PCB Footprint: RES0402_0-5; Library Ref: RESISTOR
R149 R175 = RESISTOR_Dup5: RES 10K 1/20W 5% 0201; Mistral Part No: 110010070051-R; Mfr_name: NIC COMPONENTS; Mfr_part_number: NRC02J103TRF; Part_type: RESISTORS\FIXED; Alternate_mfr_name_A: KOA SPEER; Alternate_mfr_part_number_A: RK73B1HTTC103J; Project: PB_BUGBASE; Voltage: 50V; Customs_HS_Code: 85332119; Custom_Duty: 15%; NI_MARK: DNI; PCB Footprint: RES0201; Library Ref: RESISTOR; Tolerance: 5%; Wattage: 1/20W; Package: 0201; Distributor_name: NA; Distributor_part_number: NA; Distributor_name_A: NA; Distributor_part_number_A: NA; Height: 0.30MM; Weight: NA; Temperature: -55°C+125°C; Datasheet: Y:\MIS_DATABASE\DATASHEETS\RESISTORS\NRC SERIES.PDF; Crtd /date: MUDDU/100710; Chkd/date: SUHAS/280910
R150 R164 R415 = RESISTOR_Dup5: as R20 on sheet 19-EEPROM,PRESENCE DETECTION & TEMP SENSOR; MECHANICAL 3D STEP FILE: RES0402_0-5; RoHS: Pb-Free; Chkd/date: VASANTHA/061216; Crtd /date: MAZHAR/230805; Datasheet: Y:\MIS_DATABASE\DATASHEETS\RESISTORS\YAGEO-RC0402.PDF; Temperature: -55°C+155°C; Weight: 0.65mg; Height: 0.40MM; Distributor_part_number: 311-10KJRCT-ND; Distributor_name: DIGIKEY; Package: 0402; Wattage: 1/16W; Tolerance: 5%; PCB Footprint: RES0402_0-5; Library Ref: RESISTOR; Footprint Ref: RES0402_0-5; Library Path: Y:\MIS_DATABASE\Library\ALTIUM_TOOL\SCHEMATICS_PARTS\MS_DISCRETE_Library.schlib; Footprint Path: Y:\MIS_DATABASE\Library\ALTIUM_TOOL\PCB_FOOTPRINTS\Altium_Footprint_Lib.PcbLib
R156 R174 = RESISTOR_Dup5: RES 10K 1/20W 5% 0201; Alternate_mfr_part_number_A: RK73B1HTTC103J; Alternate_mfr_name_A: KOA SPEER; Part_type: RESISTORS\FIXED; Mfr_part_number: NRC02J103TRF; Mfr_name: NIC COMPONENTS; Mistral Part No: 110010070051-R; Custom_Duty: 15%; Customs_HS_Code: 85332119; Voltage: 50V; Project: PB_BUGBASE; NI_MARK: DNI; Chkd/date: SUHAS/280910; Crtd /date: MUDDU/100710; Datasheet: Y:\MIS_DATABASE\DATASHEETS\RESISTORS\NRC SERIES.PDF; Temperature: -55°C+125°C; Weight: NA; Height: 0.30MM; Distributor_part_number_A: NA; Distributor_name_A: NA; Distributor_part_number: NA; Distributor_name: NA; Package: 0201; Wattage: 1/20W; Tolerance: 5%; PCB Footprint: RES0201; Library Ref: RESISTOR
R160 R412 = RESISTOR_Dup5: as R22 on sheet 19-EEPROM,PRESENCE DETECTION & TEMP SENSOR; Tolerance: 5%; Wattage: 1/16W; Package: 0402; Distributor_name: DIGIKEY; Distributor_part_number: 311-10KJRCT-ND; Height: 0.40MM; Weight: 0.65mg; Temperature: -55°C+155°C; Datasheet: Y:\MIS_DATABASE\DATASHEETS\RESISTORS\YAGEO-RC0402.PDF; Crtd /date: MAZHAR/230805; Chkd/date: VASANTHA/061216; RoHS: Pb-Free; MECHANICAL 3D STEP FILE: RES0402_0-5; PCB Footprint: RES0402_0-5; Library Ref: RESISTOR; Footprint Ref: RES0402_0-5; Library Path: Y:\MIS_DATABASE\Library\ALTIUM_TOOL\SCHEMATICS_PARTS\MS_DISCRETE_Library.schlib; Footprint Path: Y:\MIS_DATABASE\Library\ALTIUM_TOOL\PCB_FOOTPRINTS\Altium_Footprint_Lib.PcbLib
R409 = RESISTOR_Dup5: as R21 on sheet 19-EEPROM,PRESENCE DETECTION & TEMP SENSOR; MECHANICAL 3D STEP FILE: RES0402_0-5; RoHS: Pb-Free; Chkd/date: VASANTHA/061216; Crtd /date: MAZHAR/230805; Datasheet: Y:\MIS_DATABASE\DATASHEETS\RESISTORS\YAGEO-RC0402.PDF; Temperature: -55°C+155°C; Weight: 0.65mg; Height: 0.40MM; Distributor_part_number: 311-10KJRCT-ND; Distributor_name: DIGIKEY; Package: 0402; Wattage: 1/16W; Tolerance: 5%; PCB Footprint: RES0402_0-5; Library Ref: RESISTOR; Footprint Ref: RES0402_0-5; Library Path: Y:\MIS_DATABASE\Library\ALTIUM_TOOL\SCHEMATICS_PARTS\MS_DISCRETE_Library.schlib; Footprint Path: Y:\MIS_DATABASE\Library\ALTIUM_TOOL\PCB_FOOTPRINTS\Altium_Footprint_Lib.PcbLib
R417 = RESISTOR_Dup5: as R19 on sheet 19-EEPROM,PRESENCE DETECTION & TEMP SENSOR; Tolerance: 5%; Wattage: 1/16W; Package: 0402; Distributor_name: DIGIKEY; Distributor_part_number: 311-10KJRCT-ND; Height: 0.40MM; Weight: 0.65mg; Temperature: -55°C+155°C; Datasheet: Y:\MIS_DATABASE\DATASHEETS\RESISTORS\YAGEO-RC0402.PDF; Crtd /date: MAZHAR/230805; Chkd/date: VASANTHA/061216; RoHS: Pb-Free; MECHANICAL 3D STEP FILE: RES0402_0-5; PCB Footprint: RES0402_0-5; Library Ref: RESISTOR; Footprint Ref: RES0402_0-5; Library Path: Y:\MIS_DATABASE\Library\ALTIUM_TOOL\SCHEMATICS_PARTS\MS_DISCRETE_Library.schlib; Footprint Path: Y:\MIS_DATABASE\Library\ALTIUM_TOOL\PCB_FOOTPRINTS\Altium_Footprint_Lib.PcbLib
R449 = RESISTOR_Dup5: RES 220E 1/16W 5% 0402; Part_type: RESISTORS\FIXED; Mfr_part_number: ERJ-2GEJ221X; Mfr_name: PANASONIC-ECG; Mistral Part No: 110009030506-R; Custom_Duty: 15%; Customs_HS_Code: 85332119; Project: RED EYE; Voltage: NA; Chkd/date: VASANTHA/291216; Crtd /date: GEETHA/260406; Datasheet: Y:\MIS_DATABASE\DATASHEETS\RESISTORS\ERJ12.PDF; Height: 0.40MM; Distributor_part_number: P220JCT-ND; Distributor_name: DIGIKEY; Package: 0402; Wattage: 1/16W; Tolerance: 5%; Library Ref: RESISTOR; PCB Footprint: RES0402_0-5; Weight: 0.8g/1000pcs; Temperature: -55°C+155°C; MECHANICAL 3D STEP FILE: RES0402_0-5; Library Path: Y:\MIS_DATABASE\Library\ALTIUM_TOOL\SCHEMATICS_PARTS\MS_DISCRETE_Library.schlib; Footprint Path: Y:\MIS_DATABASE\Library\ALTIUM_TOOL\PCB_FOOTPRINTS\Altium_Footprint_Lib.PcbLib
R456 = RESISTOR_Dup5: as R473 on sheet 20-RGMII ETHERNET PHY - ICSSG PRG2_PRU0; MECHANICAL 3D STEP FILE: RES0603_0-75; Chkd/date: VASANTHA/060217; Crtd /date: USMAN/111207; Datasheet: Y:\MIS_DATABASE\DATASHEETS\RESISTORS\PAN-ERJ-3GE.PDF; Temperature: -55°C+155°C; Weight: 2mg; Height: 0.55MM; Distributor_part_number: P1.0MGCT-ND; Distributor_name: DIGIKEY; Package: 0603; Wattage: 1/10W; Tolerance: 5%; PCB Footprint: RES0603_0-75; Library Ref: RESISTOR
RA7 = RESARR_ISO4: RES ARRAY 22E 31mW 5% 0402; Mistral Part No: 110009030021-R; Mfr_name: PANASONIC-ECG; Mfr_part_number: EXB-28V220JX; Part_type: RESISTORS\ARRAY; Project: KHAN_MAIN; Voltage: NA; SIGNAL_MODEL: RESA1; Tolerance: 5%; Wattage: 31mW; Package: 0402; Distributor_name: DIGIKEY; Distributor_part_number: Y7220CT-ND; Height: 0.45MM; Weight: 2mg; Temperature: -55°C+125°C; Datasheet: Y:\MIS_DATABASE\DATASHEETS\RESISTORS\EXB-2HV.PDF; Crtd /date: USMAN/261108; Chkd/date: MAZHAR/291208; MECHANICAL 3D STEP FILE: RESA_EXB28V_0402-4_0-5; PCB Footprint: RESA_EXB28V_0402-4_0-5; Library Ref: RESARR_ISO4
TP12 = TESTPOINT: as TP74 on sheet 19-EEPROM,PRESENCE DETECTION & TEMP SENSOR; Mfr_part_number: TP40_SMD; Part_type: TESTPOINT; Package: SMD; Distributor_name: NA; Distributor_part_number: NA; Height: NA; Crtd /date: MAZHAR/190505; Chkd/date: MAZHAR/190505; Voltage: NA; Wattage: NA; Weight: NA; Temperature: NA; Datasheet: NA; MECHANICAL 3D STEP FILE: NA; Library Path: Y:\MIS_DATABASE\Library\ALTIUM_TOOL\SCHEMATICS_PARTS\MS_DISCRETE_Library.schlib; Footprint Path: Y:\MIS_DATABASE\Library\ALTIUM_TOOL\PCB_FOOTPRINTS\Altium_Footprint_Lib.PcbLib; PCB Footprint: TP40_SMD; Library Ref: TESTPOINT; Footprint Ref: TP40_SMD; RoHS: NA
TP14 = TESTPOINT: as TP55 on sheet 21-RGMII ETHERNET PHY - ICSSG PRG2_PRU1; Footprint Path: Y:\MIS_DATABASE\Library\ALTIUM_TOOL\PCB_FOOTPRINTS\Altium_Footprint_Lib.PcbLib; Library Path: Y:\MIS_DATABASE\Library\ALTIUM_TOOL\SCHEMATICS_PARTS\MS_DISCRETE_Library.schlib; Datasheet: NA; Temperature: NA; Weight: NA; Wattage: NA; Voltage: NA; Tolerance: NA; Mfr_part_number: TP40_SMD; Part_type: TESTPOINT; Package: SMD; Distributor_name: NA; Distributor_part_number: NA; Height: NA; Crtd /date: MAZHAR/190505; Chkd/date: MAZHAR/190505; PCB Footprint: TP40_SMD; Library Ref: TESTPOINT; Footprint Ref: TP40_SMD; RoHS: NA
U22 = DP83867IRRGZ_VQFN48: as U31 on sheet 20-RGMII ETHERNET PHY - ICSSG PRG2_PRU0; MECHANICAL 3D STEP FILE: QFN48_19-68_280X280_1; Chkd/date: MANIRAJA/110817; Crtd /date: MANIRAJA/110817; Datasheet: Y:\MIS_DATABASE\DATASHEETS\ICS\DIGITAL\BUSTRANSCEIVER\DP83867I.PDF; Temperature: -40°C+85°C; Weight: NA; Height: 1.00MM; Distributor_part_number: DP83867IRRGZT-ND; Distributor_name: DIGIKEY; Package: VQFN48; Voltage: NA; Tolerance: NA; Mfr_part_number: DP83867IRRGZ; PCB Footprint: QFN48_19-68_280X280_1; Library Ref: DP83867IRRGZ_VQFN48
U29 = SN74AVC2T245RSWR_QFN10: IC DUAL-BIT DUAL SUPPLY BUS TRANSCEIVER QFN10; Mistral Part No: 143009030061-R; Mfr_name: TEXAS INSTRUMENTS; Part_type: ICS\TELECOM\TRANSCEIVER; Project: AXON; Customs_HS_Code: 85423100; Custom_Duty: 15%; Mfr_part_number: SN74AVC2T245RSWR; Package: QFN10; Distributor_name: DIGIKEY; Distributor_part_number: 296-23684-1-ND; Height: 0.55MM; Temperature: -40°C+85°C; Datasheet: Y:\MIS_DATABASE\DATASHEETS\ICS\DIGITAL\BUSTRANSCEIVER\SN74AVC2T245RSWR.PDF; Crtd /date: USMAN/130309; Chkd/date: SUHAS/031110; RoHS: Sb/ Br FREE; PCB Footprint: QFN10_15-74_75X60; Library Ref: SN74AVC2T245RSWR_QFN10
U30 = TXS0102DCUR_VSSOP8: IC 2BIT BI-DIR VOLTAGE-LEVEL TRANSLATOR US8(VSSOP8); Part_type: ICS\INTERFACE\LEVEL TRANSLATOR; Mfr_name: TEXAS INSTRUMENTS; Mistral Part No: 141009030376-R; Custom_Duty: 15%; Customs_HS_Code: 85423100; Wattage: NA; Project: SD_WATERLOO; Footprint Path: Y:\MIS_DATABASE\Library\ALTIUM_TOOL\PCB_FOOTPRINTS\Altium_Footprint_Lib.PcbLib; Library Path: Y:\MIS_DATABASE\Library\ALTIUM_TOOL\SCHEMATICS_PARTS\MS_MISCINTERFACE_Library.schlib; MECHANICAL 3D STEP FILE: VSSOP8_19-68_85X95_0-9; Chkd/date: MANIRAJA/130617; Crtd /date: SHREESHAIL/190108; Datasheet: Y:\MIS_DATABASE\DATASHEETS\ICS\INTERFACE\TXS0102.PDF; Temperature: -40°C+85°C; Weight: 9.6mg; Height: 0.90MM; Distributor_part_number: 296-21931-1-ND; Distributor_name: DIGIKEY; Package: US8; Voltage: NA; Tolerance: NA; Mfr_part_number: TXS0102DCUR; PCB Footprint: VSSOP8_19-68_85X95_0-9; Library Ref: TXS0102DCUR_VSSOP8; Footprint Ref: VSSOP8_19-68_85X95_0-9
U34 = AM654X_BGA784: IC MAXWELL MICRO CONTROLLER UNIT BGA784; Mistral Part No: 141217100003; Mfr_name: TEXAS INSTRUMENTS; Mfr_part_number: MAXWELL M4_EVM; Part_type: ICS\DIGITAL\MICROCONTROLLER; Project: TI_MAXIE_CPB; Tolerance: NA; Customs_HS_Code: 85423100; Custom_Duty: 15%; Voltage: NA; Wattage: NA; Package: BGA784; Distributor_name: NA; Distributor_part_number: NA; Height: 1.63MM; Weight: NA; Temperature: NA; Datasheet: Y:\MIS_DATABASE\DATASHEETS\ICS\DIGITAL\MICROCONTROLLER\MAXWELLM4.PDF; Crtd /date: MANIRAJA/130717; Chkd/date: MANIRAJA/130717; MECHANICAL 3D STEP FILE: BGA784_31-49_910X910_1-7; PCB Footprint: BGA784_31-49_910X910_1-7; Library Ref: AM654X_BGA784
U82 = SN74LVC1G08DBVRE4_SOT23-5: as U86 on sheet 20-RGMII ETHERNET PHY - ICSSG PRG2_PRU0; RoHS: Sb/ Br FREE; Chkd/date: SUHAS/221010; Crtd /date: USMAN/151008; Datasheet: Y:\MIS_DATABASE\DATASHEETS\ICS\DIGITAL\GATES\SN74LVC1G08.PDF; Temperature: -40°C+85°C; Height: 1.45MM; Distributor_part_number: SN74LVC1G08DBVRE4-ND; Distributor_name: DIGIKEY; Package: SOT23-5; Mfr_part_number: SN74LVC1G08DBVRE4; PCB Footprint: SOT23-5; Library Ref: SN74LVC1G08DBVRE4_SOT23-5

## Sheet 23-TEST AUTOMATION.SchDoc
size 513 x 386 mm
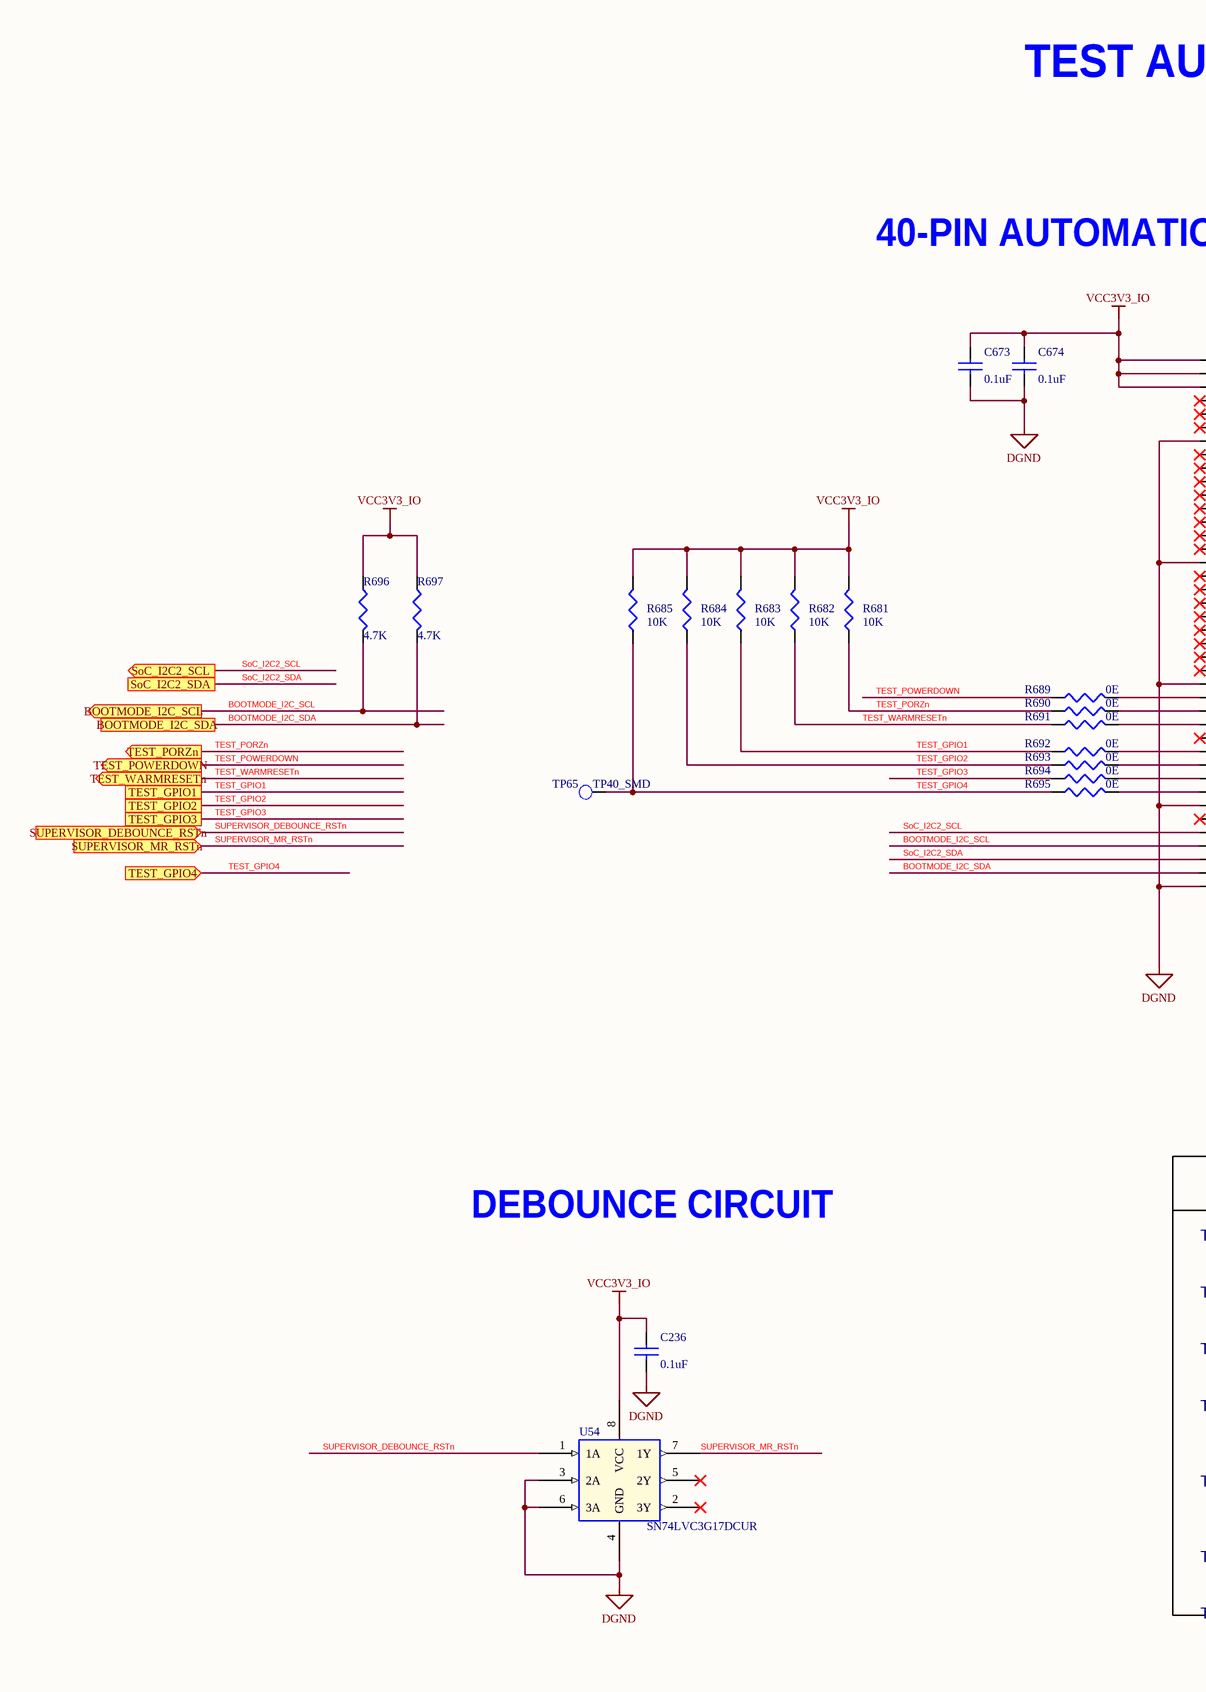
[diagram p38: 23-TEST AUTOMATION.SchDoc, left]
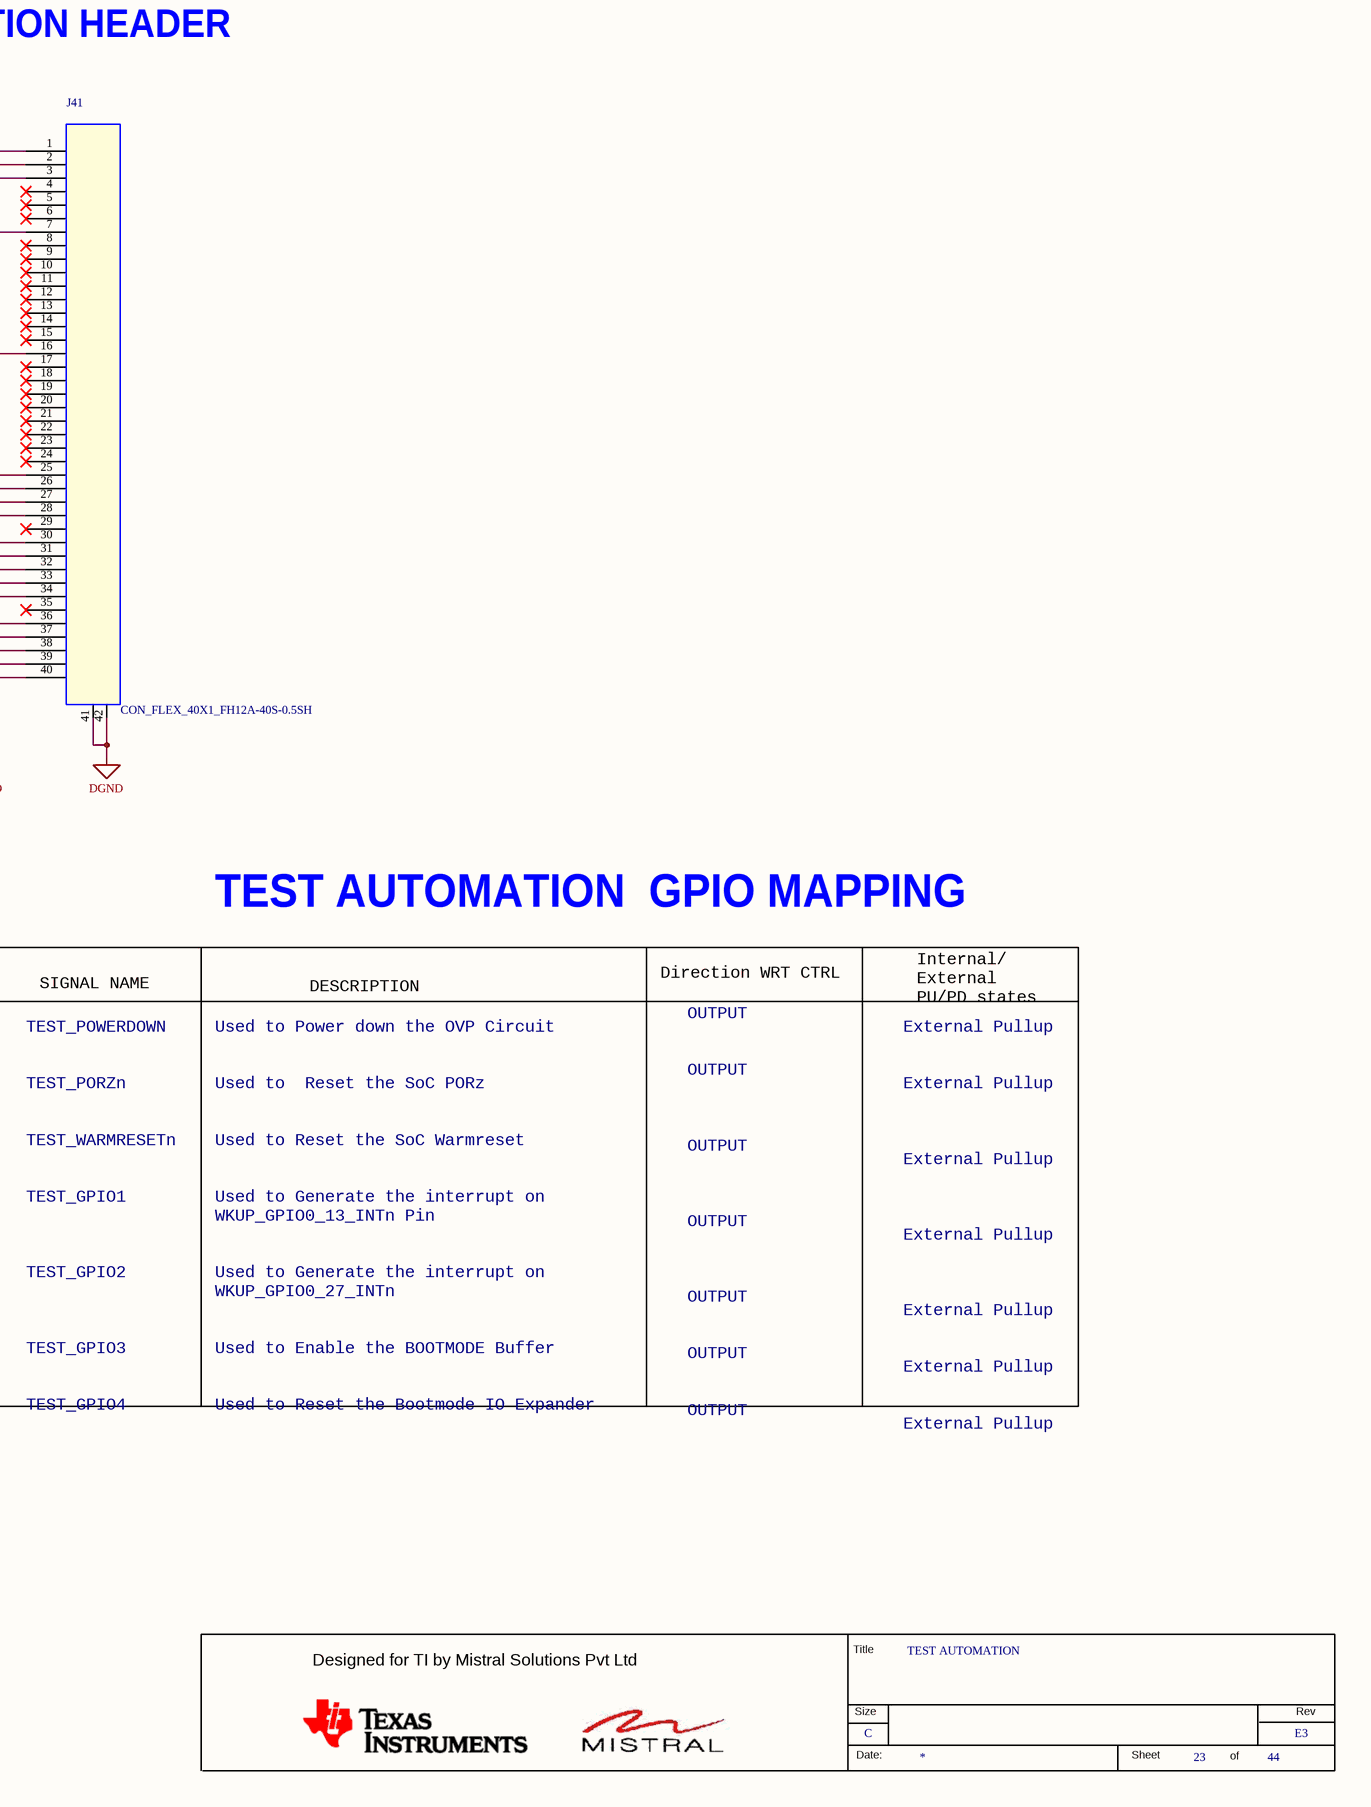
[diagram p39: 23-TEST AUTOMATION.SchDoc, right]

### Parts
(Parts that share a designator on the sheet are numbered #1, #2 ... from top to bottom, then left to right.)
*#23  RevCode: E3  Title: TEST AUTOMATION  Page Size: C  Page Number: 23  Page Count: 44  (hidden comment: MISTRAL_TITLEBLK_CSIZE)  (graphical)
C236  0.1uF  [CAP0201_0-5]
C673  0.1uF  [CAP0201_0-5]
C674  0.1uF  [CAP0201_0-5]
J41  CON_FLEX_40X1_FH12A-40S-0.5SH  [CON_FLEX40X1_FH12A_S_R_S]
R681  10K  [RES0402_0-5]
R682  10K  [RES0402_0-5]
R683  10K  [RES0402_0-5]
R684  10K  [RES0402_0-5]
R685  10K  [RES0402_0-5]
R689  0E  [RES0402_0-5]
R690  0E  [RES0402_0-5]
R691  0E  [RES0402_0-5]
R692  0E  [RES0402_0-5]
R693  0E  [RES0402_0-5]
R694  0E  [RES0402_0-5]
R695  0E  [RES0402_0-5]
R696  4.7K  [RES0402]
R697  4.7K  [RES0402]
TP65  TP40_SMD  [TP40_SMD]
U54  SN74LVC3G17DCUR  [VSSOP8_19-68_85X95_0-9]

### Ports
BOOTMODE_I2C_SCL (out), BOOTMODE_I2C_SDA, SoC_I2C2_SCL (out), SoC_I2C2_SDA, SUPERVISOR_DEBOUNCE_RSTn (in), SUPERVISOR_MR_RSTn (in), TEST_GPIO1, TEST_GPIO2, TEST_GPIO3, TEST_GPIO4 (in), TEST_PORZn (out), TEST_POWERDOWN (out), TEST_WARMRESETn (out)

### Nets
DGND: C236.2 C673.2 C674.2 J41.7 J41.16 J41.25 J41.34 J41.40 J41.41 J41.42 U54.3(2A) U54.4(GND) U54.6(3A)
VCC3V3_IO: C236.1 C673.1 C674.1 J41.1 J41.2 J41.3 R681.2 R682.2 R683.2 R684.2 R685.2 R696.1 R697.1 U54.8(VCC)
BOOTMODE_I2C_SCL: J41.37 R696.2 ; port BOOTMODE_I2C_SCL
BOOTMODE_I2C_SDA: J41.39 R697.2 ; port BOOTMODE_I2C_SDA
SoC_I2C2_SCL: J41.36 ; port SoC_I2C2_SCL
SoC_I2C2_SDA: J41.38 ; port SoC_I2C2_SDA
SUPERVISOR_DEBOUNCE_RSTn: U54.1(1A) ; port SUPERVISOR_DEBOUNCE_RSTn
SUPERVISOR_MR_RSTn: U54.7(1Y) ; port SUPERVISOR_MR_RSTn
TEST_GPIO1: R683.1 R692.1 ; port TEST_GPIO1
TEST_GPIO2: R684.1 R693.1 ; port TEST_GPIO2
TEST_GPIO3: R694.1 ; port TEST_GPIO3
TEST_GPIO4: R685.1 R695.1 TP65.1(TP) ; port TEST_GPIO4
TEST_PORZn: R681.1 R690.1 ; port TEST_PORZn
TEST_POWERDOWN: R689.1 ; port TEST_POWERDOWN
TEST_WARMRESETn: R682.1 R691.1 ; port TEST_WARMRESETn
NetJ41_26: J41.26 R689.2
NetJ41_27: J41.27 R690.2
NetJ41_28: J41.28 R691.2
NetJ41_30: J41.30 R692.2
NetJ41_31: J41.31 R693.2
NetJ41_32: J41.32 R694.2
NetJ41_33: J41.33 R695.2

Not connected (* = marked no-connect by the designer): J41 4* 5* 6* 8* 9* 10* 11* 12* 13* 14* 15* 17* 18* 19* 20* 21* 22* 23* 24* 29* 35*; U54 2(3Y)* 5(2Y)*

### Notes on the sheet
- TEST AUTOMATION
- 40-PIN AUTOMATION HEADER
- TEST AUTOMATION  GPIO MAPPING
- SIGNAL NAME
- Direction WRT CTRL
- Internal/
  External
  PU/PD states
- DEBOUNCE CIRCUIT
- DESCRIPTION
- TEST_POWERDOWN
  TEST_PORZn
  TEST_WARMRESETn
  TEST_GPIO1
  TEST_GPIO2
  TEST_GPIO3
  TEST_GPIO4
- OUTPUT
  OUTPUT
  OUTPUT
  OUTPUT
  OUTPUT
  OUTPUT
  OUTPUT
- External Pullup
  External Pullup
  External Pullup
  External Pullup
  External Pullup
  External Pullup
  External Pullup
- Used to Power down the OVP Circuit
  Used to  Reset the SoC PORz
  Used to Reset the SoC Warmreset
  Used to Generate the interrupt on
  WKUP_GPIO0_13_INTn Pin
  Used to Generate the interrupt on
  WKUP_GPIO0_27_INTn
  Used to Enable the BOOTMODE Buffer
  Used to Reset the Bootmode IO Expander
- (in symbol MISTRAL_TITLEBLK_CSIZE) Title; Designed for TI by Mistral Solutions Pvt Ltd; Size; Rev; Date:; Sheet; of

### Library data of the parts
*#23 = MISTRAL_TITLEBLK_CSIZE: Issue: 1.0; Page Create Date: March  8, 1995; Page Modify Date: *
C236 C674 = CAP_Dup5: as C126 on sheet 20-RGMII ETHERNET PHY - ICSSG PRG2_PRU0; Library Ref: CAP; Tolerance: 10%; Voltage: 16V; Package: 0201; Distributor_name: DIGIKEY; Distributor_part_number: 490-16742-1-ND; Height: 0.33MM; Weight: 0.33mg; Temperature: -55°C+85°C; Datasheet: Y:\MIS_DATABASE\DATASHEETS\CAPACITORS\GRM033R61C104KE84.PDF; Crtd /date: MANIRAJA/120218; Chkd/date: MANIRAJA/120218; MECHANICAL 3D STEP FILE: CAP0201_0-5; PCB Footprint: CAP0201_0-5
C673 = CAP_Dup5: as C13 on sheet 19-EEPROM,PRESENCE DETECTION & TEMP SENSOR; Library Ref: CAP; MECHANICAL 3D STEP FILE: CAP0201_0-5; Chkd/date: MANIRAJA/120218; Crtd /date: MANIRAJA/120218; Datasheet: Y:\MIS_DATABASE\DATASHEETS\CAPACITORS\GRM033R61C104KE84.PDF; Temperature: -55°C+85°C; Weight: 0.33mg; Height: 0.33MM; Distributor_part_number: 490-16742-1-ND; Distributor_name: DIGIKEY; Package: 0201; Voltage: 16V; Tolerance: 10%; PCB Footprint: CAP0201_0-5
J41 = CON_FLEX_40X1_FH12A-40S-0.5SH: CON FPC 40X1 0.50MM PITCH RT TOP SMD; Part_type: CONNECTOR\FPC; Mfr_part_number: FH12A-40S-0.5SH(55); Mfr_name: HIROSE ELECTRIC EUROPE; Mistral Part No: 150009030176-R; Remarks: CON_FLEX40X1_FH12A_S_R_S_PMP take this footprint for PMP LCD BOARD/ROHS INFORMATION ADDED(BAVISH/270911)Mistral part# updated with -R.; Custom_Duty: 24%; Customs_HS_Code: 85369090; Project: PMP LCD BOARD; Library Ref: CON_FLEX_40X1_FH12A-40S-0.5SH; Chkd/date: SHREESHAIL/201106; Crtd /date: MAZHAR/171106; Datasheet: Y:\MIS_DATABASE\DATASHEETS\CONNECTORS\FH12SERIES.PDF; Height: 2.00MM; Distributor_part_number: HFK40CT-ND; Distributor_name: DIGIKEY; Package: SMD; PCB Footprint: CON_FLEX40X1_FH12A_S_R_S
R681-R685 = RESISTOR_Dup5: as R22 on sheet 19-EEPROM,PRESENCE DETECTION & TEMP SENSOR; Footprint Path: Y:\MIS_DATABASE\Library\ALTIUM_TOOL\PCB_FOOTPRINTS\Altium_Footprint_Lib.PcbLib; Library Path: Y:\MIS_DATABASE\Library\ALTIUM_TOOL\SCHEMATICS_PARTS\MS_DISCRETE_Library.schlib; Footprint Ref: RES0402_0-5; Library Ref: RESISTOR; Tolerance: 5%; Wattage: 1/16W; Package: 0402; Distributor_name: DIGIKEY; Distributor_part_number: 311-10KJRCT-ND; Height: 0.40MM; Weight: 0.65mg; Temperature: -55°C+155°C; Datasheet: Y:\MIS_DATABASE\DATASHEETS\RESISTORS\YAGEO-RC0402.PDF; Crtd /date: MAZHAR/230805; Chkd/date: VASANTHA/061216; RoHS: Pb-Free; MECHANICAL 3D STEP FILE: RES0402_0-5; PCB Footprint: RES0402_0-5
R689 R691-R693 R695 = RESISTOR_Dup4: as R467 on sheet 20-RGMII ETHERNET PHY - ICSSG PRG2_PRU0; Footprint Path: Y:\MIS_DATABASE\Library\ALTIUM_TOOL\PCB_FOOTPRINTS\Altium_Footprint_Lib.PcbLib; Library Path: Y:\MIS_DATABASE\Library\ALTIUM_TOOL\SCHEMATICS_PARTS\MS_DISCRETE_Library.schlib; Footprint Ref: RES0402_0-5; Library Ref: RESISTOR; RoHS: Pb-Free; Chkd/date: VASANTHA/201216; Crtd /date: MUDDU/190810; Datasheet: Y:\MIS_DATABASE\DATASHEETS\RESISTORS\CRCW0603.PDF; Temperature: -55°C+155°C; Weight: 0.65g/1000pcs; Height: 0.40MM; Distributor_part_number: 541-0.0JCT-ND; Distributor_name: DIGIKEY; Package: 0402; Wattage: 1/16W; Tolerance: NA; MECHANICAL 3D STEP FILE: RES0402_0-5; PCB Footprint: RES0402_0-5
R690 R694 = RESISTOR_Dup4: as R468 on sheet 20-RGMII ETHERNET PHY - ICSSG PRG2_PRU0; Footprint Path: Y:\MIS_DATABASE\Library\ALTIUM_TOOL\PCB_FOOTPRINTS\Altium_Footprint_Lib.PcbLib; Library Path: Y:\MIS_DATABASE\Library\ALTIUM_TOOL\SCHEMATICS_PARTS\MS_DISCRETE_Library.schlib; Footprint Ref: RES0402_0-5; Library Ref: RESISTOR; Voltage: NA; Wattage: 1/16W; Package: 0402; Distributor_name: DIGIKEY; Distributor_part_number: 541-0.0JCT-ND; Height: 0.40MM; Weight: 0.65g/1000pcs; Temperature: -55°C+155°C; Datasheet: Y:\MIS_DATABASE\DATASHEETS\RESISTORS\CRCW0603.PDF; Crtd /date: MUDDU/190810; Chkd/date: VASANTHA/201216; RoHS: Pb-Free; MECHANICAL 3D STEP FILE: RES0402_0-5; PCB Footprint: RES0402_0-5
R696 R697 = RESISTOR_Dup5: RES 4.7K 1/16W 5% 0402; Part_type: RESISTORS\FIXED; Mfr_part_number: RC0402JR-074K7L; Mfr_name: YAGEO AMERICA; Mistral Part No: 110009030792-R; Custom_Duty: 15%; Customs_HS_Code: 85332119; Voltage: NA; Project: TMDXCSK368; Library Ref: RESISTOR; Chkd/date: VASANTHA/130516; Crtd /date: VASANTHA/130516; Datasheet: Y:\MIS_DATABASE\DATASHEETS\RESISTORS\YAGEO-RC0402.PDF; Temperature: -55°C+155°C; Weight: NA; Height: 0.55MM; Distributor_part_number: 311-4.7KJRCT-ND; Distributor_name: DIGIKEY; Package: 0402; Wattage: 1/16W; Tolerance: 5%; PCB Footprint: RES0402
TP65 = TESTPOINT: as TP74 on sheet 19-EEPROM,PRESENCE DETECTION & TEMP SENSOR; RoHS: NA; Footprint Ref: TP40_SMD; Library Ref: TESTPOINT; Mfr_part_number: TP40_SMD; Part_type: TESTPOINT; Package: SMD; Distributor_name: NA; Distributor_part_number: NA; Height: NA; Crtd /date: MAZHAR/190505; Chkd/date: MAZHAR/190505; Voltage: NA; Wattage: NA; Weight: NA; Temperature: NA; Datasheet: NA; MECHANICAL 3D STEP FILE: NA; Library Path: Y:\MIS_DATABASE\Library\ALTIUM_TOOL\SCHEMATICS_PARTS\MS_DISCRETE_Library.schlib; Footprint Path: Y:\MIS_DATABASE\Library\ALTIUM_TOOL\PCB_FOOTPRINTS\Altium_Footprint_Lib.PcbLib; PCB Footprint: TP40_SMD
U54 = SN74LVC3G17DCUR_VSSOP8: IC TRIPLE SCHMITT-TRIGGER BUFFER VSSOP8; Part_type: ICS\DIGITAL\COMBINATIONAL; Mfr_name: TEXAS INSTRUMENTS; Mistral Part No: 141017090019-R; Custom_Duty: 15%; Customs_HS_Code: 85423100; Wattage: NA; Project: TI_MAXIE_CPB; Library Ref: SN74LVC3G17DCUR_VSSOP8; MECHANICAL 3D STEP FILE: VSSOP8_19-68_85X95_0-9; Chkd/date: MANIRAJA/280917; Crtd /date: MANIRAJA/280917; Datasheet: Y:\MIS_DATABASE\DATASHEETS\ICS\DIGITAL\COMBINATIONAL\SN74LVC3G17.PDF; Temperature: -40°C+125°C; Weight: 9.6mg; Height: 0.90MM; Distributor_part_number: 296-18818-1-ND; Distributor_name: DIGIKEY; Package: VSSOP8; Voltage: NA; Tolerance: NA; Mfr_part_number: SN74LVC3G17DCUR; PCB Footprint: VSSOP8_19-68_85X95_0-9